# EAGLE design Qwiic_Long_Distance-PCA9615 (EAGLE 7.7.0)
ABBREV: hb1; PROJECT: Heading Board
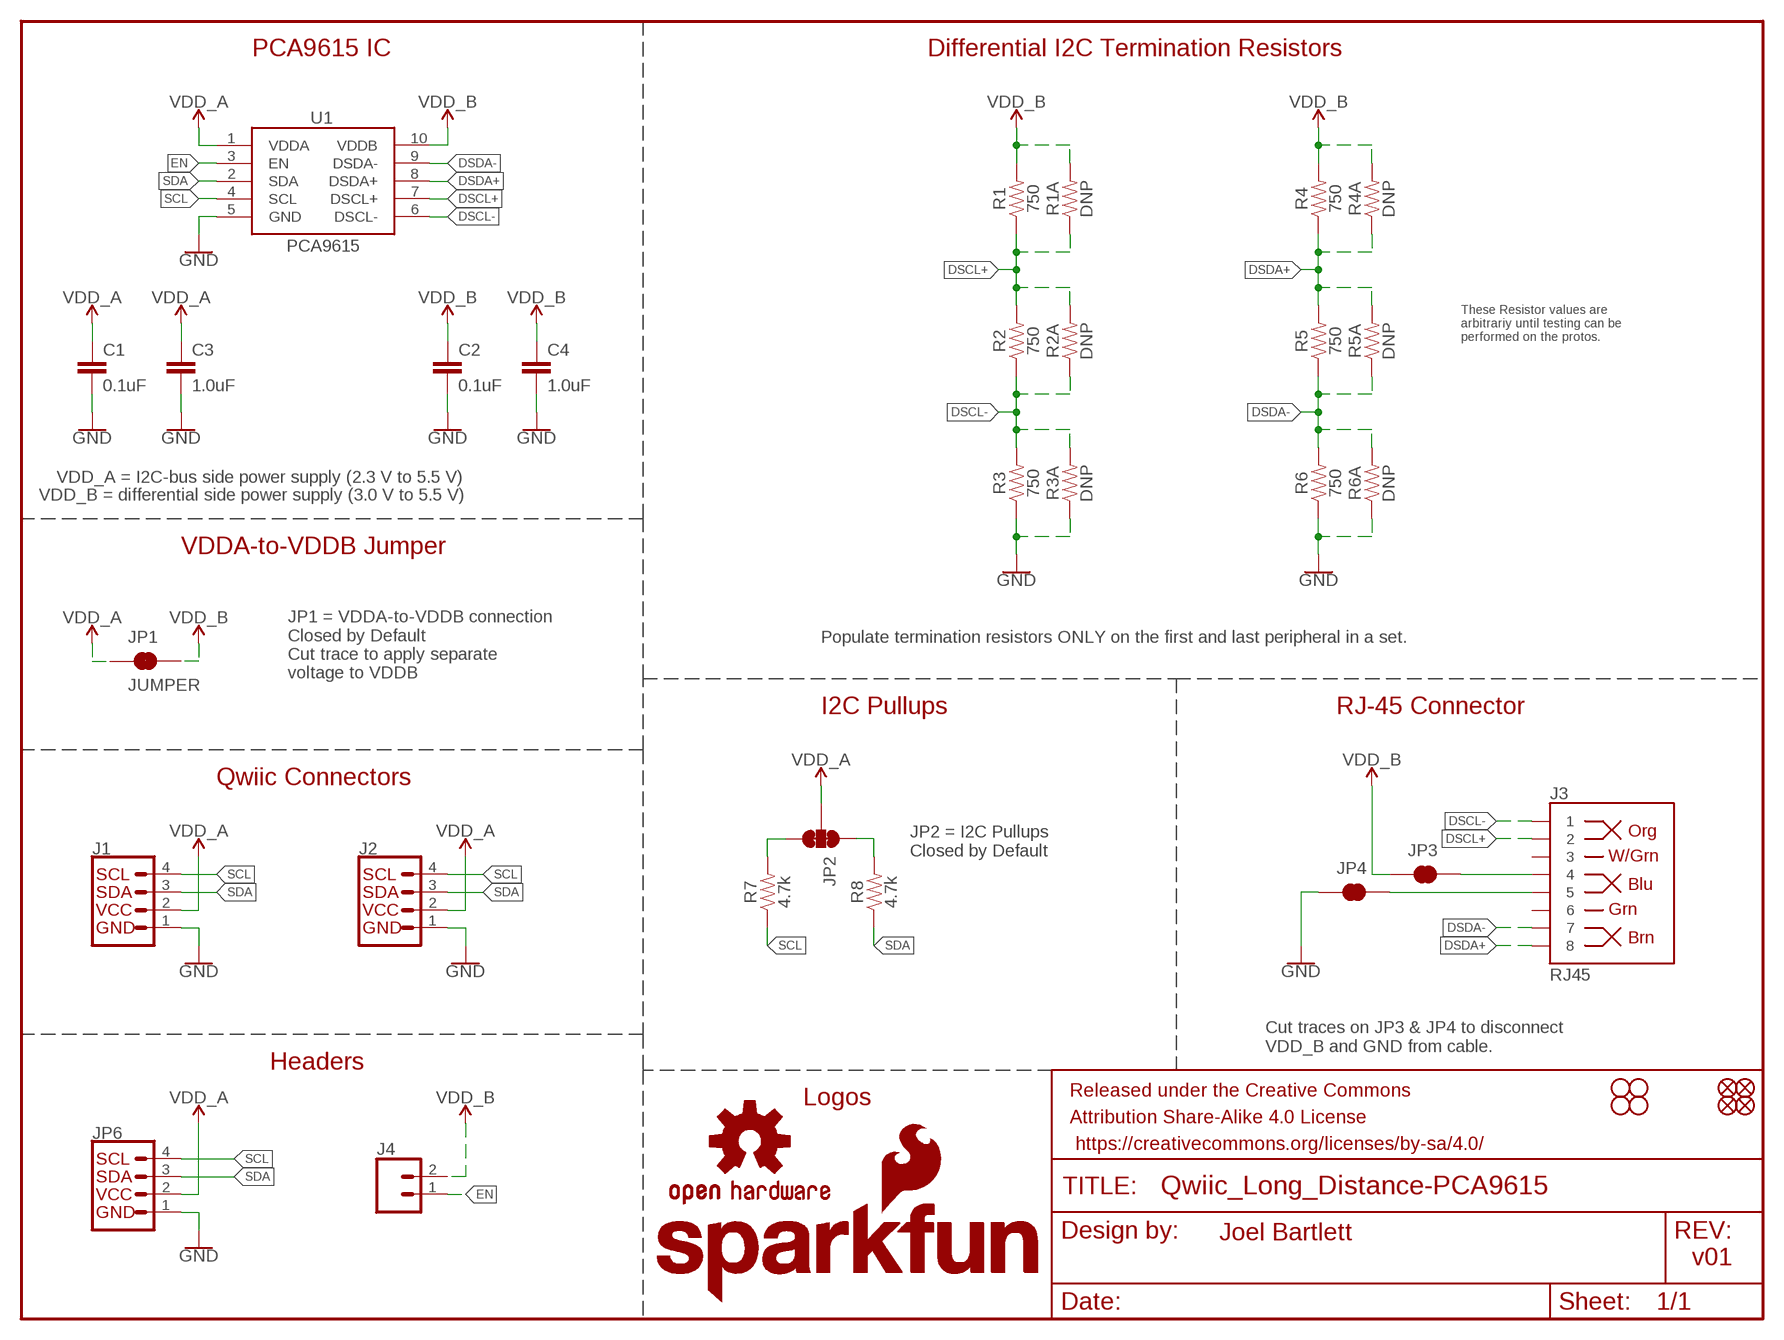
[diagram p0: schematic, sheet 1]

## Parts
C1  0.1uF  0.1UF-0603-25V-(+80/-20%)  [0603]
C2  0.1uF  0.1UF-0603-25V-(+80/-20%)  [0603]
C3  1.0uF  1.0UF-0603-16V-10%  [0603]
C4  1.0uF  1.0UF-0603-16V-10%  [0603]
FD1  FIDUCIALUFIDUCIAL  [FIDUCIAL-MICRO]
FD2  FIDUCIALUFIDUCIAL  [FIDUCIAL-MICRO]
FD3  FIDUCIALUFIDUCIAL  [FIDUCIAL-MICRO]
FD4  FIDUCIALUFIDUCIAL  [FIDUCIAL-MICRO]
FRAME1  FRAME-LETTER  [CREATIVE_COMMONS]
H1  STAND-OFF  [STAND-OFF]
H2  STAND-OFF  [STAND-OFF]
H3  STAND-OFF  [STAND-OFF]
H4  STAND-OFF  [STAND-OFF]
J1  QWIIC_CONNECTORJS-1MM  [1X04_1MM_RA]
J2  QWIIC_CONNECTORJS-1MM  [1X04_1MM_RA]
J3  RJ45  RJ45-8  [RJ45-8]
J4  CONN_02  [1X02]
JP1  JUMPER  JUMPER-SMT_2_NC_TRACE_SILK  [SMT-JUMPER_2_NC_TRACE_SILK]
JP2  JUMPER-SMT_3_2-NC_TRACE_SILK  [SMT-JUMPER_3_2-NC_TRACE_SILK]
JP3  JUMPER-SMT_2_NC_TRACE_SILK  [SMT-JUMPER_2_NC_TRACE_SILK]
JP4  JUMPER-SMT_2_NC_TRACE_SILK  [SMT-JUMPER_2_NC_TRACE_SILK]
JP6  I2C_STANDARDSILK  [1X04]
LOGO1  OSHW-LOGOM  [OSHW-LOGO-M]
LOGO2  SFE_LOGO_NAME.1_INCH  [SFE_LOGO_NAME_.1]
LOGO5  SFE_LOGO_NAME_FLAME.1_INCH  [SFE_LOGO_NAME_FLAME_.1]
R1  750  750OHM-0603-1/10W-1%  [0603]
R1A  DNP  RESISTORAXIAL-0.3  [AXIAL-0.3]
R2  750  750OHM-0603-1/10W-1%  [0603]
R2A  DNP  RESISTORAXIAL-0.3  [AXIAL-0.3]
R3  750  750OHM-0603-1/10W-1%  [0603]
R3A  DNP  RESISTORAXIAL-0.3  [AXIAL-0.3]
R4  750  750OHM-0603-1/10W-1%  [0603]
R4A  DNP  RESISTORAXIAL-0.3  [AXIAL-0.3]
R5  750  750OHM-0603-1/10W-1%  [0603]
R5A  DNP  RESISTORAXIAL-0.3  [AXIAL-0.3]
R6  750  750OHM-0603-1/10W-1%  [0603]
R6A  DNP  RESISTORAXIAL-0.3  [AXIAL-0.3]
R7  4.7k  4.7KOHM-0603-1/10W-1%  [0603]
R8  4.7k  4.7KOHM-0603-1/10W-1%  [0603]
U1  PCA9615  [TSSOP10]

## Nets
DSCL+: J3.2 R1.1 R1A.P$1 R2.2 R2A.P$2 U1.7(DSCL+)
DSCL-: J3.1 R2.1 R2A.P$1 R3.2 R3A.P$2 U1.6(DSCL-)
DSDA+: J3.8 R4.1 R4A.P$1 R5.2 R5A.P$2 U1.8(DSDA+)
DSDA-: J3.7 R5.1 R5A.P$1 R6.2 R6A.P$2 U1.9(DSDA-)
EN: J4.1 U1.3(EN)
GND: C1.2 C2.2 C3.2 C4.2 J1.1 J2.1 JP4.1 JP6.1(GND) R3.1 R3A.P$1 R6.1 R6A.P$1 U1.5(GND)
N$1: J3.4 JP3.2
N$2: J3.5 JP4.2
N$3: JP2.1 R8.2
N$4: JP2.3 R7.2
SCL: J1.4 J2.4 JP6.4(SCL) R7.1 U1.4(SCL)
SDA: J1.3 J2.3 JP6.3(SDA) R8.1 U1.2(SDA)
VDD_A: C1.1 C3.1 J1.2 J2.2 JP1.1 JP2.2 JP6.2(VCC) U1.1(VDDA)
VDD_B: C2.1 C4.1 J4.2 JP1.2 JP3.1 R1.2 R1A.P$2 R4.2 R4A.P$2 U1.10(VDDB)
Unconnected: J3.3 J3.6

## Notes on the sheet
- PCA9615 IC | Differential I2C Termination Resistors
- These Resistor values are
  arbitrariy until testing can be
  performed on the protos.
- VDD_A = I2C-bus side power supply (2.3 V to 5.5 V)
- VDD_B = differential side power supply (3.0 V to 5.5 V)
- VDDA-to-VDDB Jumper
- Populate termination resistors ONLY on the first and last peripheral in a set.
- JP1 = VDDA-to-VDDB connection
  Closed by Default
  Cut trace to apply separate 
  voltage to VDDB
- I2C Pullups | RJ-45 Connector
- Qwiic Connectors
- JP2 = I2C Pullups
  Closed by Default
- Cut traces on JP3 & JP4 to disconnect 
  VDD_B and GND from cable.
- Headers
- Logos
- Joel Bartlett
- v01

## Library data of the parts
C1 C2 = SparkFun-Capacitors:0.1UF: 0.1µF ceramic capacitors A capacitor is a passive two-terminal electrical component used to store electrical energy temporarily in an electric field.; PROD_ID: CAP-00810
C3 C4 = SparkFun-Capacitors:1.0UF: 1µF ceramic capacitors A capacitor is a passive two-terminal electrical component used to store electrical energy temporarily in an electric field.; PROD_ID: CAP-00868
FD1-FD4 = SparkFun-Aesthetics:FIDUCIAL: Fiducial Alignment Points Point-of-reference for pick-and-place machines and other optical instruments.
FRAME1 = SparkFun-Aesthetics:FRAME-LETTER: Schematic Frame - Letter Standard 8.5x11 US Letter frame
H1-H4 = SparkFun-Hardware:STAND-OFF: Stand Off Drill holes for mechanically mounting via screws, standoffs, etc. Note: Use the keepout ring to avoid running the screw head into surrounding components. Variant Overviews STAND-OFF - Mechanical footprint for a #4 phillips button head screw. STAND-OFF-TIGHT - Mechanical footprint for a #4 phillips button head screw, Example SparkFun Products Screw - Phillips Head (1/4", 4-40, 10 pack) <https://www.sparkfun.com/products/10453> (PRT-10453) Screw - Phillips Head (1/2", 4-40, 10 pack) <https://www.sparkfun.com/products/10452> (PRT-10452) Screw - Phillips Head (3/4", 4-40, 10 pack) <https://www.sparkfun.com/products/10451> (PRT-10451) Screw - Phillips Head (1", 4-40, 10 pack) <https://www.sparkfun.com/products/10450> (PRT-10450)
J1 J2 = SparkFun-Connectors:QWIIC_CONNECTOR: SparkFun I2C Standard Qwiic Connector An SMD 1mm pitch JST connector makes it easy and quick (get it? Qwiic?) to connect I2C devices to each other. The Qwiic system <http://www.sparkfun.com/qwiic> enables fast and solderless connection between popular platforms and various sensors and actuators. We carry 200mm <https://www.sparkfun.com/products/14204>, 100mm <https://www.sparkfun.com/products/14205>, 50mm <https://www.sparkfun.com/products/14206>, and breadboard friendly <https://www.sparkfun.com/products/14207> Qwiic cables. We also offer 10 pcs strips <https://www.sparkfun.com/products/14323> the SMD connectors.; PROD_ID: CONN-13694
J3 = SparkFun-Connectors:RJ45-8: RJ45 Jack - 8 pin Simple RJ45, 8-pin connection. Commonly used for Cat5, Cat5e, and Cat6 Ethernet cables. Here is the connector we sell at SparkFun: RJ45 8-Pin Connector <https://www.sparkfun.com/products/643> (PRT-00643) Datasheet <https://cdn.sparkfun.com/datasheets/Prototyping/04908.pdf> It is used on this SparkFun product: SparkFun RJ45 Breakout <https://www.sparkfun.com/products/716> (BOB-00716) Note, you may also be interested in the "MAGJACK" version of this. It is basically a RJ45 connector, but also has some status LEDs built into the connector housing. You can check that out in this library at the device named "MAGJACK.dev" and see these products online: RJ45 Ethernet MagJack-Compatible <https://www.sparkfun.com/products/8534> (PRT-08534) SparkFun RJ45 MagJack Breakout <https://www.sparkfun.com/products/13021> (BOB-13021); PROD_ID: CONN-08506; SF_ID: PRT-00643
J4 = SparkFun-Connectors:CONN_02: Multi connection point. Often used as Generic Header-pin footprint for 0.1 inch spaced/style header connections On any of the 0.1 inch spaced packages, you can populate with these: Break Away Headers - Straight <https://www.sparkfun.com/products/116> (PRT-00116) Break Away Male Headers - Right Angle <https://www.sparkfun.com/products/553> (PRT-00553) Female Headers <https://www.sparkfun.com/products/115> (PRT-00115) Break Away Headers - Machine Pin <https://www.sparkfun.com/products/117> (PRT-00117) Break Away Female Headers - Swiss Machine Pin <https://www.sparkfun.com/products/743> (PRT-00743) For SCREWTERMINALS and SPRING TERMINALS visit here: Screw Terimnals on SparkFun.com <https://www.sparkfun.com/search/results?term=Screw+Terminals> (5mm/3.5mm/2.54mm spacing) This device is also useful as a general connection point to wire up your design to another part of your project. Our various solder wires solder well into these plated through hole pads. Hook-Up Wire - Assortment (Stranded, 22 AWG) <https://www.sparkfun.com/products/11375> (PRT-11375) Hook-Up Wire - Assortment (Solid Core, 22 AWG) <https://www.sparkfun.com/products/11367> (PRT-11367) View the entire wire category on our website here <https://www.sparkfun.com/categories/141> Special notes: Molex polarized connector foot print use with: PRT-08233 with associated crimp pins and housings. 2.54_SCREWTERM for use with PRT-10571. 3.5mm Screw Terminal footprints for PRT-08084 5mm Screw Terminal footprints for use with PRT-08432
JP1 JP3 JP4 = SparkFun-Jumpers:JUMPER-SMT_2_NC_TRACE: Normally closed trace jumper This jumper has a trace between two pads so it's normally closed (NC). Use a razor knife to open the connection. For best results follow the IPC guidelines for cutting traces: Cutout at least 0.063 mm (0.005 in). Remove all loose material to clean up the cut area. Seal the cut with an approved epoxy. Reapply solder to reclose the connection.
JP2 = SparkFun-Jumpers:JUMPER-SMT_3_2-NC_TRACE: Normally closed trace jumper (2 of 2 connections) This jumper has a trace between all three pads so they are normally closed (NC). Use a razor knife to open the connection(s). For best results follow the IPC guidelines for cutting traces: Cutout at least 0.063 mm (0.005 in). Remove all loose material to clean up the cut area. Seal the cut with an approved epoxy. Reapply solder to reclose the connection(s).
JP6 = SparkX:I2C_STANDARD: SparkFun I2C Standard Pinout Header SparkFun has standardized on a pinout for all I2C based sensor breakouts. This pinout allows I2C boards to be plugged directly into the headers on Arduino Uno compatible boards, and to be daisy chained easily. Example SparkFun Products: SparkFun Atmospheric Sensor Breakout - BME280 <https://www.sparkfun.com/products/13676> SparkFun Altitude/Pressure Sensor Breakout - MPL3115A2 <https://www.sparkfun.com/products/11084> SparkFun TOF Range Finder Sensor - VL6180 <https://www.sparkfun.com/products/12785>
LOGO1 = SparkFun-Aesthetics:OSHW-LOGO: Open-Source Hardware (OSHW) Logo This logo indicates the piece of hardware it is found on incorporates a OSHW license and/or adheres to the definition of open source hardware found here: http://freedomdefined.org/OSHW
LOGO2 = SparkFun-Aesthetics:SFE_LOGO_NAME: SparkFun Font Logo This is the SparkFun name logo. The logo on the schematic will always be the same size; the package variant is the height of the flame part of the logo (or the height the flame would be, if it were drawn). Default layer for the logo on the board is tSilk.
LOGO5 = SparkFun-Aesthetics:SFE_LOGO_NAME_FLAME: SparkFun Font Logo w/ Flame This is the SparkFun full logo. The logo on the schematic will always be the same size; the package variant is the height of the flame part of the logo. Default layer for the logo on the board is tSilk.
R1-R6 = SparkFun-Resistors:750OHM: 750Ω resistor A resistor is a passive two-terminal electrical component that implements electrical resistance as a circuit element. Resistors act to reduce current flow, and, at the same time, act to lower voltage levels within circuits. - Wikipedia; PROD_ID: RES-07824
R1A R2A R3A R4A R5A R6A = SparkFun-Resistors:RESISTOR: Generic Resistor Package
R7 R8 = SparkFun-Resistors:4.7KOHM: 4.7kΩ resistor A resistor is a passive two-terminal electrical component that implements electrical resistance as a circuit element. Resistors act to reduce current flow, and, at the same time, act to lower voltage levels within circuits. - Wikipedia; PROD_ID: RES-07857
U1 = Openponics:PCA9615

## Net classes
0 default: width 0.203 mm
1 power: width 0.381 mm, clearance 0.254 mm

## Board
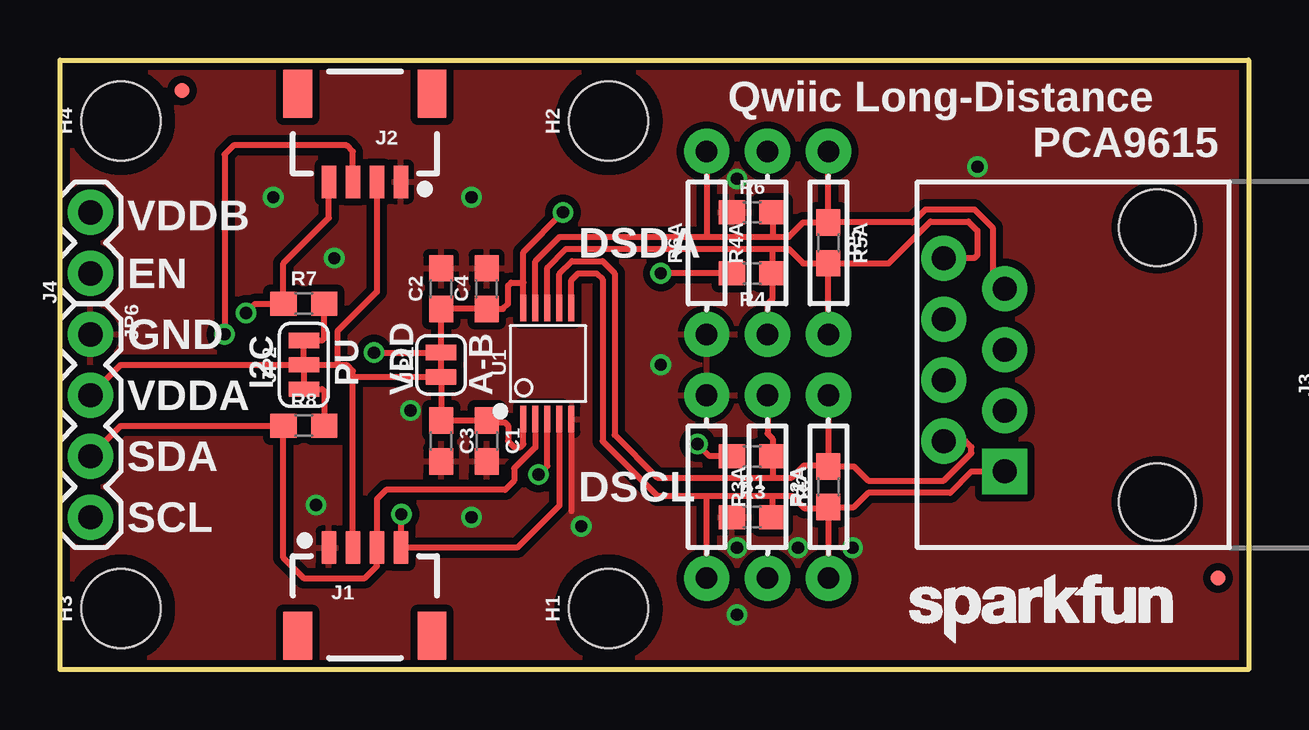
[diagram p1: board, top side]
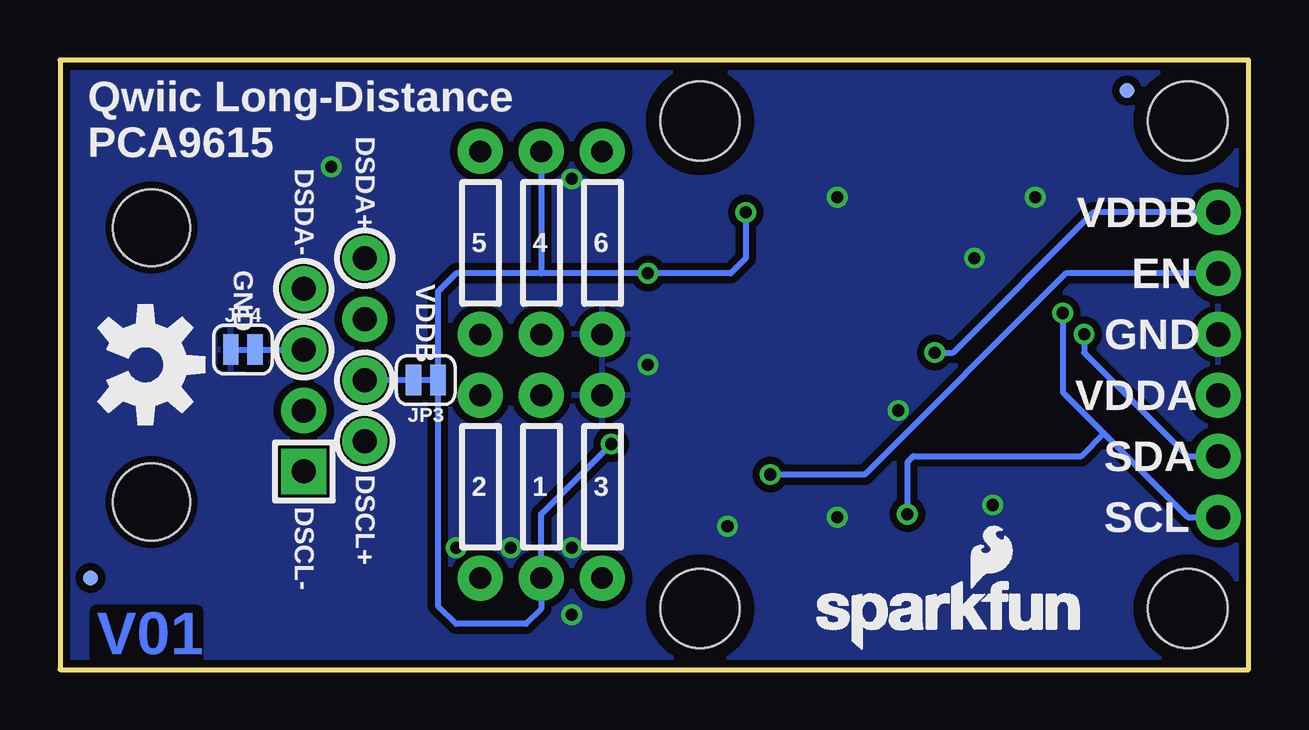
[diagram p2: board, bottom side, seen from below]

Size 49.53 x 25.4 mm. Coordinates in mm from the lower left corner, seen from the top.
Outline: 49.53,0 0,0 0,25.4 49.53,25.4 49.53,0
Copper layers (1*16): Top 0.035mm / dielectric 1.5mm / Bottom 0.035mm
Design rules "SparkFun-2-layer-TIGHT": minimum track width 7mil, minimum drill 15mil, track to track 7mil, track to pad 7mil, pad to pad 7mil, via to via 7mil, smd to smd 7mil, copper to edge 7mil, drill to drill 7mil, minimum pad ring 7mil, minimum via ring 7mil, stop-mask expansion 4mil, vias tented up to drill 25mil, thermal gap 10mil

### Footprints (pad centres in the part's own frame; a part is rotated, then mirrored left to right if it is on the bottom)
0603 = smd 1.1 x 1: 1 -0.85,0; 2 0.85,0
FIDUCIAL-MICRO = smd 0.635 x 0.635: 1 0,0
STAND-OFF = hole 3.302: 0,0
1X04_1MM_RA = smd 0.6 x 1.35: 1 -1.5,0; 2 -0.5,0; 3 0.5,0; 4 1.5,0 | smd 1.2 x 2: NC1 2.8,-3.675; NC2 -2.8,-3.675
RJ45-8 = drill 1 pad 1.88 square: 1 -4.445,6.35 | drill 1 pad 1.88: 2 -3.175,8.89; 3 -1.905,6.35; 4 -0.635,8.89; 5 0.635,6.35; 6 1.905,8.89; 7 3.175,6.35; 8 4.445,8.89 | hole 3.2: -5.715,0; 5.715,0
1X02 = drill 1.016 pad 1.88: 1 0,0; 2 2.54,0
SMT-JUMPER_2_NC_TRACE_SILK = smd 0.635 x 1.27: 1 -0.508,0; 2 0.508,0
SMT-JUMPER_3_2-NC_TRACE_SILK = smd 0.635 x 1.27: 1 -1.016,0; 2 0,0; 3 1.016,0
1X04 = drill 1.016 pad 1.88: 1 0,0; 2 2.54,0; 3 5.08,0; 4 7.62,0
AXIAL-0.3 = drill 0.9 pad 1.88: P$1 -3.81,0; P$2 3.81,0
TSSOP10 = smd 1.1 x 0.25: 1 -2.259,1.018; 2 -2.259,0.517; 3 -2.259,0.018; 4 -2.259,-0.482; 5 -2.259,-0.988; 6 2.366,-0.988; 7 2.366,-0.482; 8 2.366,0.018; 9 2.366,0.517; 10 2.366,1.018

### Placement (x,y rotation side)
C1  17.78,9.53 270 top
C2  15.88,15.88 90 top
C3  15.88,9.53 270 top
C4  17.78,15.88 90 top
FD1  5.08,24.13 0 top
FD2  48.26,3.81 0 top
FD3  5.08,24.13 0 bottom
FD4  48.26,3.81 0 bottom
FRAME1  -16.51,-8.89 0 top  (outside the outline)
H1  22.86,2.54 90 top
H2  22.86,22.86 90 top
H3  2.54,2.54 90 top
H4  2.54,22.86 90 top
J1  12.7,5.08 0 top
J2  12.7,20.32 180 top
J3  45.72,12.7 90 top
J4  1.27,16.51 90 top
JP1  15.88,12.7 90 top
JP2  10.16,12.7 90 top
JP3  34.29,12.06 180 bottom
JP4  41.91,13.34 0 bottom
JP6  1.27,13.97 270 top
LOGO1  45.97,12.7 270 bottom
LOGO2  34.92,0.64 0 top
LOGO5  18.41,0.76 0 bottom
R1  28.84,8.89 180 top
R1A  29.48,7.62 270 top
R2  32.02,7.62 90 top
R2A  32.02,7.62 90 top
R3  28.84,6.35 0 top
R3A  26.94,7.62 270 top
R4  28.84,16.51 180 top
R4A  29.48,17.78 90 top
R5  32.02,17.78 270 top
R5A  32.02,17.78 270 top
R6  28.84,19.05 0 top
R6A  26.94,17.78 90 top
R7  10.16,15.24 0 top
R8  10.16,10.16 0 top
U1  20.32,12.7 90 top

### Tracks (layer width: path | path; a pad name or v marks a point on that pad's centre or on a via)
DSCL+
  Top 0.254: U1.7 20.8,16.48 21.34,17.02 22.61,17.02 23.11,16.51 23.11,9.78 24.89,8 29.7,8 | 29.7,8 R1.1 29.7,9.61 29.48,9.83 R1A.P$1 | R2.2 33.08,8.47 33.67,7.87 36.83,7.87 37.97,9.02 37.97,9.27 37.72,9.53 J3.2 | R2A.P$2 R2.2 | 29.7,8 30.5,8 31,8.51 31.98,8.51 R2.2
DSCL-
  Top 0.254: U1.6 21.31,16.23 21.59,16.51 22.35,16.51 22.61,16.26 22.61,9.53 24.89,7.24 26.94,7.24 | 26.94,7.24 29.7,7.24 | R3.2 29.7,7.24 | R3A.P$2 26.94,7.24 | R2.1 33.08,6.77 33.67,7.37 37.08,7.37 37.97,8.26 J3.1 | R2.1 R2A.P$1 | 29.7,7.24 30.5,7.24 31,6.73 31.98,6.73 R2.1
DSDA+
  Top 0.254: U1.8 20.3,16.75 21.08,17.53 29.7,17.53 | 29.7,17.53 30.37,17.53 30.96,16.93 R5.2 | R4A.P$1 29.48,15.24 29.7,15.46 R4.1 29.7,17.53 | R5.2 34.53,16.93 36.27,18.67 37.85,18.67 38.23,18.29 38.23,17.27 38.1,17.14 J3.8 | R5A.P$2 R5.2
DSDA-
  Top 0.254: U1.9 19.8,17.01 20.83,18.03 26.94,18.03 | 26.94,18.03 29.7,18.03 | 29.7,18.03 30.37,18.03 30.96,18.63 R5.1 | R6A.P$2 26.94,18.03 | R6.2 29.7,18.03 | R5.1 R5A.P$1 | J3.7 38.86,16.38 38.86,18.41 38.1,19.18 36.07,19.18 35.52,18.63 R5.1
EN  (via drill 0.51)
  Top 0.254: v19.94,8.13 20.3,8.49 U1.3
  Bottom 0.254: J4.1 7.62,16.51 16,8.13 v19.94,8.13
GND  (via drill 0.51)
  Top 0.254: 21.31,6.6 21.31,10.16 U1.5
  other vias: 14.61,10.79 10.67,6.86 17.14,19.68 28.21,20.45 21.72,5.97 33.02,5.08 28.21,2.29 38.23,20.95 25.04,12.7 28.21,5.08 30.75,5.08 8.89,19.68 11.43,17.14 17.14,6.35
  pour Top (isolate 0.305): 49.53,0 0,0 0,25.4 49.53,25.4
  pour Bottom (isolate 0.305): 49.53,0 0,0 0,25.4 49.53,25.4
N$1
  Bottom 0.254: JP3.2 J3.4
N$2
  Bottom 0.254: JP4.2 J3.5
N$3
  Top 0.254: JP2.1 10.92,11.68 11.01,11.6 R8.2
N$4
  Top 0.254: JP2.3 10.92,13.72 11.01,13.8 R7.2
SCL  (via drill 0.51)
  Top 0.254: U1.4 20.8,6.83 19.05,5.08 J1.4 14.2,6.45 v14.22,6.48 | J2.4 11.2,18.82 9.31,16.93 R7.1 8.13,15.24 v7.75,14.86
  Bottom 0.254: 6.03,9.84 7.75,11.56 v7.75,14.86 | 6.03,9.84 2.54,6.35 JP6.4 | 6.03,9.84 6.99,8.89 13.97,8.89 14.22,8.64 v14.22,6.48
SDA  (via drill 0.51)
  Top 0.254: JP6.3 2.54,10.16 R8.1 9.31,4.66 10.16,3.81 12.7,3.81 13.2,4.31 J1.3 | v6.86,13.97 6.86,21.46 7.24,21.84 11.94,21.84 12.2,21.58 J2.3 | U1.2 19.8,9.26 18.92,8.38 18.92,7.87 18.54,7.49 13.59,7.49 13.2,7.1 J1.3 | J1.3 arc90 J1.3
  Bottom 0.254: v6.86,13.97 6.86,13.21 2.54,8.89 JP6.3
VDD_A
  Top 0.254: 11.56,12.7 JP2.2 2.54,12.7 JP6.2 | 11.56,12.7 11.94,12.7 12.2,12.44 12.2,12.19 | 12.2,12.19 JP1.1 15.62,12.19 15.88,11.94 C3.1 C1.1 17.87,10.29 18.54,10.29 18.67,10.16 18.67,9.53 18.92,9.27 19.18,9.27 19.3,9.4 U1.1 | J1.2 12.2,12.19 | J2.2 13.2,15.74 11.56,14.1 11.56,12.7
VDD_B  (via drill 0.51)
  Top 0.254: v13.08,13.21 JP1.2 15.62,13.21 15.88,13.46 C2.1 C4.1 18.45,15.03 18.67,15.24 18.67,16 18.8,16.13 19.3,16.13 | U1.10 19.3,16.13 | 19.3,16.13 19.3,17.4 v20.95,19.05 | R1.2 27.07,8.89 v26.56,9.4 | R4.2 v25.04,16.51
  Bottom 0.254: J4.2 6.48,19.05 12.32,13.21 v13.08,13.21 | v20.95,19.05 20.95,17.14 21.59,16.51 v25.04,16.51 29.48,16.51 | 29.48,16.51 33.02,16.51 33.78,15.75 JP3.1 33.78,2.67 33.02,1.91 30.11,1.91 29.48,2.54 R1A.P$2 29.48,6.48 v26.56,9.4 | R4A.P$2 29.48,16.51

### Text on the board
Bottom: V01
tPlace: Qwiic Long-Distance | PCA9615 | VDDB | DSDA | EN | GND | I2C | PU | VDDA | VDD | A-B | SDA | DSCL | SCL
bPlace: Qwiic Long-Distance | DSDA+ | DSDA- | PCA9615 | VDDB | 6 | 4 | 5 | GND | EN | VDDB | GND | VDDA | SDA | DSCL+ | 3 | 1 | 2 | DSCL- | SCL
Measures: Measurements in mm
tDocu: Joel Bartlett